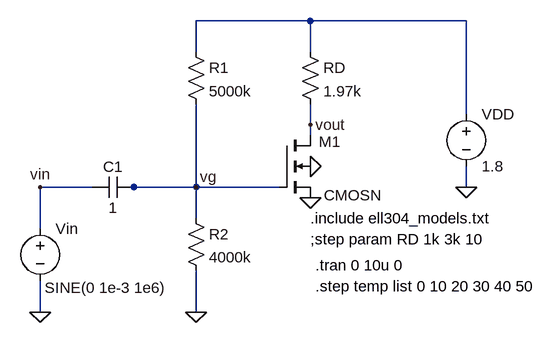
[diagram p0: schematic exmp5.asc]
exmp5.asc, the LTspice schematic file:
Version 4
SHEET 1 880 680
WIRE 240 -48 64 -48
WIRE 480 -48 240 -48
WIRE 64 0 64 -48
WIRE 240 0 240 -48
WIRE 480 96 480 -48
WIRE 240 112 240 80
WIRE 240 128 240 112
WIRE -96 208 -176 208
WIRE -32 208 -48 208
WIRE 64 208 64 80
WIRE 64 208 -32 208
WIRE 192 208 64 208
WIRE 480 208 480 176
WIRE 64 256 64 208
WIRE -176 272 -176 208
WIRE -176 400 -176 352
WIRE 64 400 64 336
FLAG 240 224 0
FLAG 240 176 0
FLAG 480 208 0
FLAG 64 400 0
FLAG -176 400 0
FLAG -176 208 vin
FLAG 240 112 vout
FLAG 64 208 vg
SYMBOL nmos4 192 128 R0
WINDOW 0 61 10 Left 2
WINDOW 3 69 92 Left 2
SYMATTR InstName M1
SYMATTR Value CMOSN
SYMATTR Value2 l=0.18u w=5u
SYMBOL res 224 -16 R0
SYMATTR InstName RD
SYMATTR Value 1.97k
SYMBOL voltage 480 80 R0
SYMATTR InstName VDD
SYMATTR Value 1.8
SYMBOL res 48 240 R0
SYMATTR InstName R2
SYMATTR Value 4000k
SYMBOL cap -32 192 R90
WINDOW 0 0 32 VBottom 2
WINDOW 3 32 32 VTop 2
SYMATTR InstName C1
SYMATTR Value 1
SYMBOL voltage -176 256 R0
WINDOW 3 7 107 Left 2
WINDOW 123 0 0 Left 0
WINDOW 39 0 0 Left 0
SYMATTR Value SINE(0 1e-3 1e6)
SYMATTR InstName Vin
SYMBOL res 48 -16 R0
SYMATTR InstName R1
SYMATTR Value 5000k
TEXT 240 256 Left 2 !.include ell304_models.txt
TEXT 240 288 Left 2 !;step param RD 1k 3k 10
TEXT 248 328 Left 2 !.tran 0 10u 0
TEXT 248 360 Left 2 !.step temp list 0 10 20 30 40 50

The netlist it stands for:
* exmp5.asc
M1 vout vg 0 0 CMOSN l=0.18u w=5u
RD N001 vout 1.97k
VDD N001 0 1.8
R2 vg 0 4000k
C1 vg vin 1
Vin vin 0 SINE(0 1e-3 1e6)
R1 N001 vg 5000k
.model NMOS NMOS
.model PMOS PMOS
.lib standard.mos
.include ell304_models.txt
;step param RD 1k 3k 10
.tran 0 10u 0
.step temp list 0 10 20 30 40 50
.backanno
.end